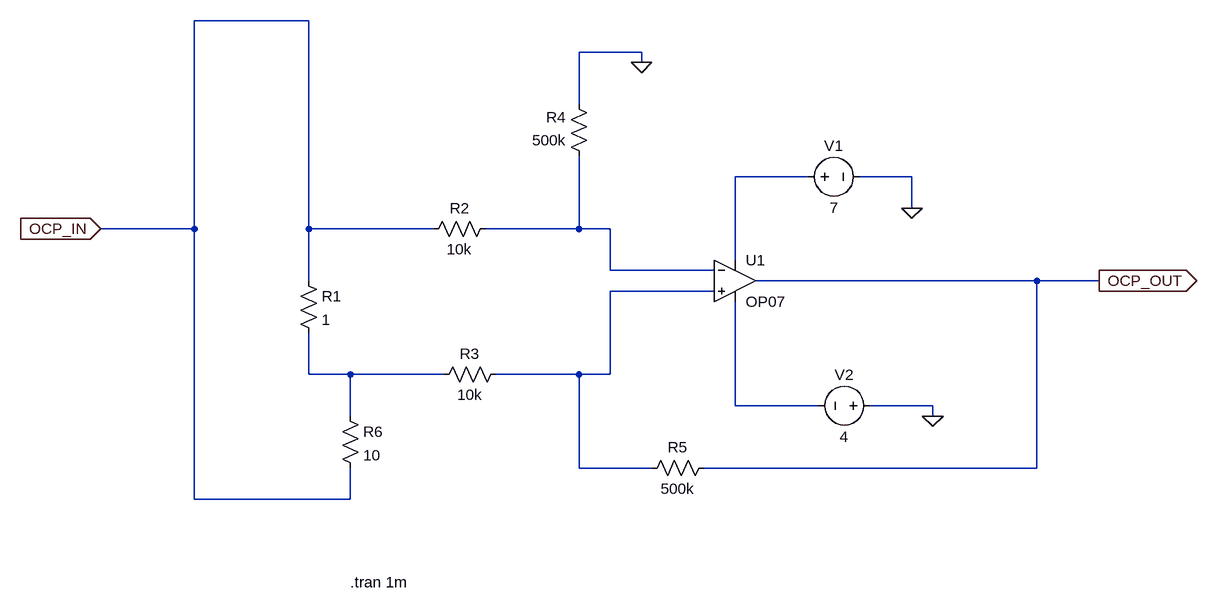
[diagram p0: schematic OCP.asc]
OCP.asc, the LTspice schematic file:
Version 4
SHEET 1 1288 752
WIRE -80 -128 -256 -128
WIRE 432 -80 336 -80
WIRE 432 -64 432 -80
WIRE 336 0 336 -80
WIRE 688 112 576 112
WIRE 848 112 768 112
WIRE 848 160 848 112
WIRE -256 192 -256 -128
WIRE -256 192 -400 192
WIRE -80 192 -80 -128
WIRE 112 192 -80 192
WIRE 336 192 336 80
WIRE 336 192 192 192
WIRE 384 192 336 192
WIRE 576 240 576 112
WIRE 384 256 384 192
WIRE 544 256 384 256
WIRE -80 272 -80 192
WIRE 1040 272 608 272
WIRE 1136 272 1040 272
WIRE 544 288 384 288
WIRE -80 416 -80 352
WIRE -16 416 -80 416
WIRE 128 416 -16 416
WIRE 336 416 208 416
WIRE 384 416 384 288
WIRE 384 416 336 416
WIRE 576 464 576 304
WIRE 704 464 576 464
WIRE 880 464 784 464
WIRE -16 480 -16 416
WIRE 880 480 880 464
WIRE 336 560 336 416
WIRE 448 560 336 560
WIRE 1040 560 1040 272
WIRE 1040 560 528 560
WIRE -256 608 -256 192
WIRE -16 608 -16 560
WIRE -16 608 -256 608
FLAG 432 -64 0
FLAG 848 160 0
FLAG 880 480 0
FLAG -400 192 OCP_IN
IOPIN -400 192 In
FLAG 1136 272 OCP_OUT
IOPIN 1136 272 Out
SYMBOL Res -96 256 R0
SYMATTR InstName R1
SYMATTR Value 1
SYMBOL Res 208 176 R90
WINDOW 0 0 56 VBottom 2
WINDOW 3 32 56 VTop 2
SYMATTR InstName R2
SYMATTR Value 10k
SYMBOL Res 224 400 R90
WINDOW 0 0 56 VBottom 2
WINDOW 3 32 56 VTop 2
SYMATTR InstName R3
SYMATTR Value 10k
SYMBOL Res 352 96 R180
WINDOW 0 36 76 Left 2
WINDOW 3 36 40 Left 2
SYMATTR InstName R4
SYMATTR Value 500k
SYMBOL Res 544 544 R90
WINDOW 0 0 56 VBottom 2
WINDOW 3 32 56 VTop 2
SYMATTR InstName R5
SYMATTR Value 500k
SYMBOL OpAmps/OP07 576 208 R0
SYMATTR InstName U1
SYMBOL Voltage 672 112 R270
WINDOW 0 32 56 VTop 2
WINDOW 3 -32 56 VBottom 2
SYMATTR InstName V1
SYMATTR Value 7
SYMBOL Res -32 464 R0
SYMATTR InstName R6
SYMATTR Value 10
SYMBOL voltage 800 464 R90
WINDOW 0 -32 56 VBottom 2
WINDOW 3 32 56 VTop 2
SYMATTR InstName V2
SYMATTR Value 4
TEXT -16 736 Left 2 !.tran 1m

The netlist it stands for:
* OCP.asc
R1 OCP_IN N004 1
R2 N002 OCP_IN 10k
R3 N003 N004 10k
R4 N002 0 500k
R5 OCP_OUT N003 500k
XU1 N003 N002 N001 N005 OCP_OUT LT1001  ; OP07, pins In+ In- V+ V- OUT
V1 N001 0 7
R6 N004 OCP_IN 10
V2 0 N005 4
.tran 1m
.lib LTC.lib
.backanno
.end